# Altium schematic sheet 3_mcu_main.schdoc: OBDH MCU Main
size A3; Engineer: Eng_2_ALT; SheetNumber: 3; SheetTotal: 6; Designed by: André M. P. Mattos; Version: v0.7; ProjectRevision: v0.7; ProjectCode: obdh2
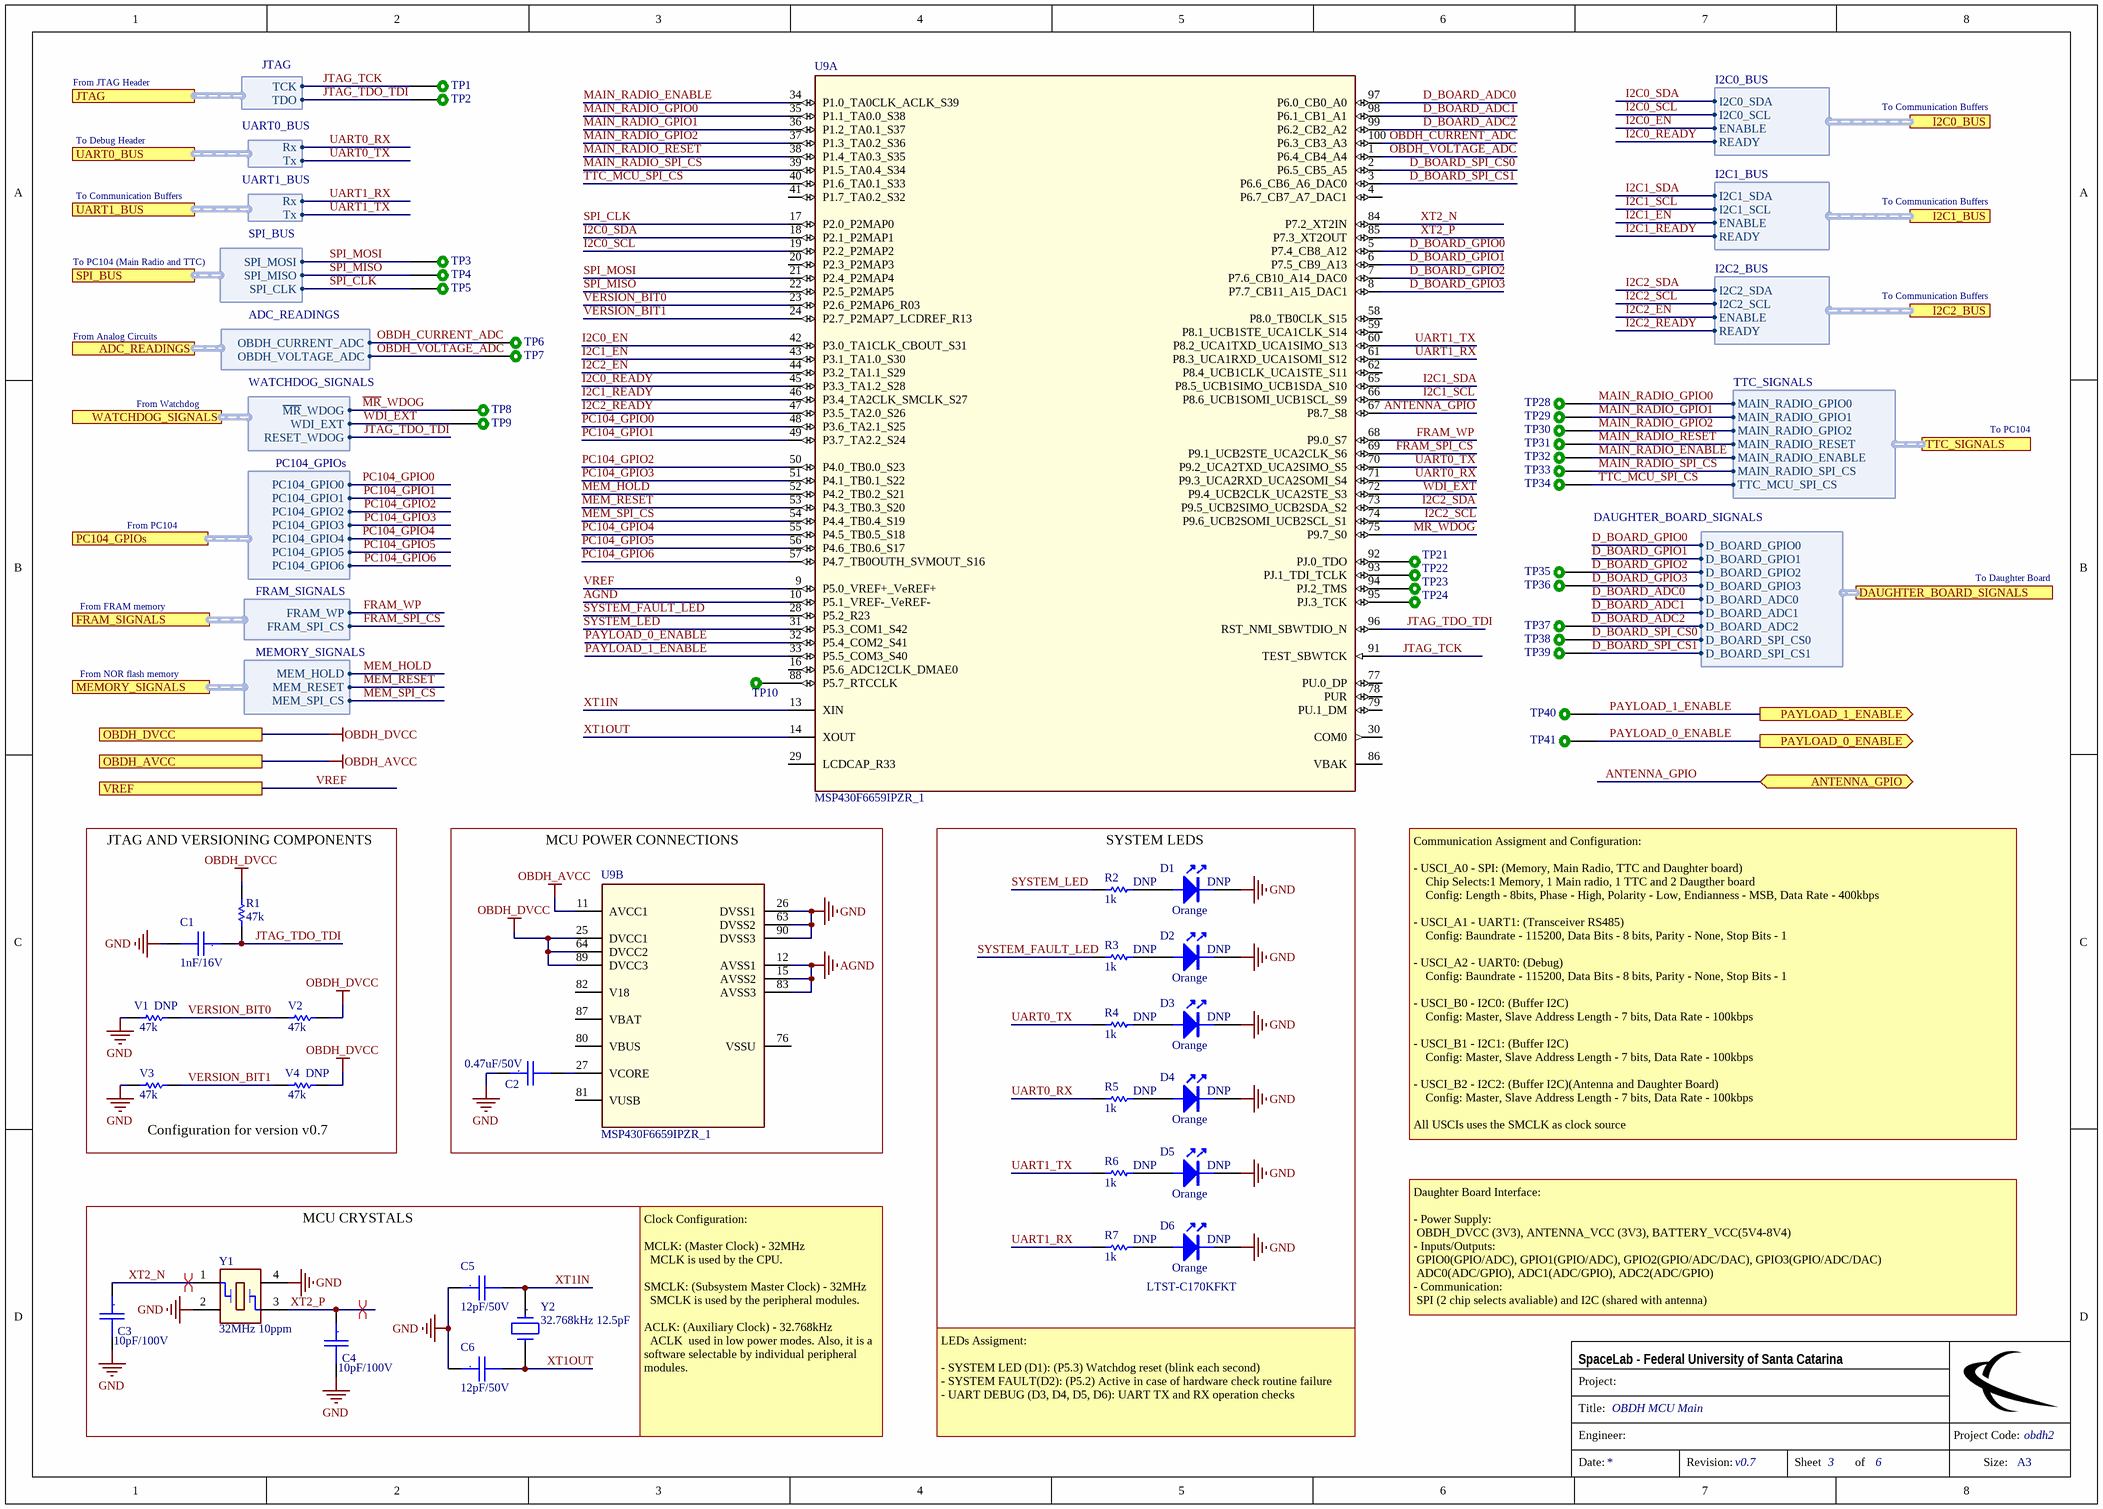
[diagram p0: 3_mcu_main.schdoc]

## Parts
C1  1nF/16V  [CC0805]
C2  0.47uF/50V  [CC0805]
C3  10pF/100V  [CC0805]
C4  10pF/100V  [CC0805]
C5  12pF/50V  [CC0805]
C6  12pF/50V  [CC0805]
D1  Orange  [0805-LED]
D2  Orange  [0805-LED]
D3  Orange  [0805-LED]
D4  Orange  [0805-LED]
D5  Orange  [0805-LED]
D6  Orange  [0805-LED]
R1  47k  [0805]
R2  1k  [0805]
R3  1k  [0805]
R4  1k  [0805]
R5  1k  [0805]
R6  1k  [0805]
R7  1k  [0805]
TP1  TEST_POINT_2  [TEST_POINT_2]  (value not drawn)  (no BOM)
TP2  TEST_POINT_2  [TEST_POINT_2]  (value not drawn)  (no BOM)
TP3  TEST_POINT_2  [TEST_POINT_2]  (value not drawn)  (no BOM)
TP4  TEST_POINT_2  [TEST_POINT_2]  (value not drawn)  (no BOM)
TP5  TEST_POINT_2  [TEST_POINT_2]  (value not drawn)  (no BOM)
TP6  TEST_POINT_2  [TEST_POINT_2]  (value not drawn)  (no BOM)
TP7  TEST_POINT_2  [TEST_POINT_2]  (value not drawn)  (no BOM)
TP8  TEST_POINT_2  [TEST_POINT_2]  (value not drawn)  (no BOM)
TP9  TEST_POINT_2  [TEST_POINT_2]  (value not drawn)  (no BOM)
TP10  TEST_POINT_2  [TEST_POINT_2]  (value not drawn)  (no BOM)
TP21  TEST_POINT_2  [TEST_POINT_2]  (value not drawn)  (no BOM)
TP22  TEST_POINT_2  [TEST_POINT_2]  (value not drawn)  (no BOM)
TP23  TEST_POINT_2  [TEST_POINT_2]  (value not drawn)  (no BOM)
TP24  TEST_POINT_2  [TEST_POINT_2]  (value not drawn)  (no BOM)
TP28  TEST_POINT_2  [TEST_POINT_2]  (value not drawn)  (no BOM)
TP29  TEST_POINT_2  [TEST_POINT_2]  (value not drawn)  (no BOM)
TP30  TEST_POINT_2  [TEST_POINT_2]  (value not drawn)  (no BOM)
TP31  TEST_POINT_2  [TEST_POINT_2]  (value not drawn)  (no BOM)
TP32  TEST_POINT_2  [TEST_POINT_2]  (value not drawn)  (no BOM)
TP33  TEST_POINT_2  [TEST_POINT_2]  (value not drawn)  (no BOM)
TP34  TEST_POINT_2  [TEST_POINT_2]  (value not drawn)  (no BOM)
TP35  TEST_POINT_2  [TEST_POINT_2]  (value not drawn)  (no BOM)
TP36  TEST_POINT_2  [TEST_POINT_2]  (value not drawn)  (no BOM)
TP37  TEST_POINT_2  [TEST_POINT_2]  (value not drawn)  (no BOM)
TP38  TEST_POINT_2  [TEST_POINT_2]  (value not drawn)  (no BOM)
TP39  TEST_POINT_2  [TEST_POINT_2]  (value not drawn)  (no BOM)
TP40  TEST_POINT_2  [TEST_POINT_2]  (value not drawn)  (no BOM)
TP41  TEST_POINT_2  [TEST_POINT_2]  (value not drawn)  (no BOM)
U9  MSP430F6659IPZR_1  [PZ0100A_N]  (parts A,B of 2)
V1  47k  [0805]
V2  47k  [0805]
V3  47k  [0805]
V4  47k  [0805]
Y1  32MHz 10ppm  [XTAL_ABM8X]
Y2  32.768kHz 12.5pF  [ABS06 0805]

## Blocks framed on the sheet
MCU POWER CONNECTIONS: C2 U9
SYSTEM LEDS: D1-D6 R2-R7
MCU CRYSTALS: C3-C6 Y1 Y2

## Ports
ADC_READINGS (harness ADC_READINGS), ANTENNA_GPIO (bidir), DAUGHTER_BOARD_SIGNALS (harness DAUGHTER_BOARD_SIGNALS), FRAM_SIGNALS (harness FRAM_SIGNALS), I2C0_BUS (harness I2C0_BUS), I2C1_BUS (harness I2C1_BUS), I2C2_BUS (harness I2C2_BUS), JTAG (harness JTAG), MEMORY_SIGNALS (harness MEMORY_SIGNALS), OBDH_AVCC, OBDH_DVCC, PAYLOAD_0_ENABLE (out), PAYLOAD_1_ENABLE (out), PC104_GPIOs (harness PC104_GPIOs), SPI_BUS (harness SPI_BUS), TTC_SIGNALS (harness TTC_SIGNALS), UART0_BUS (harness UART0_BUS), UART1_BUS (harness UART1_BUS), VREF, WATCHDOG_SIGNALS (harness WATCHDOG_SIGNALS)

## Harnesses
JTAG: TDO, TCK
UART0_BUS: Rx, Tx
ADC_READINGS: OBDH_CURRENT_ADC, OBDH_VOLTAGE_ADC
UART1_BUS: Rx, Tx
I2C0_BUS: I2C0_SCL, I2C0_SDA, ENABLE, READY
I2C1_BUS: I2C1_SCL, I2C1_SDA, ENABLE, READY
I2C2_BUS: I2C2_SCL, I2C2_SDA, ENABLE, READY
SPI_BUS: SPI_CLK, SPI_MISO, SPI_MOSI
TTC_SIGNALS: MAIN_RADIO_GPIO0, MAIN_RADIO_GPIO1, MAIN_RADIO_GPIO2, MAIN_RADIO_RESET, MAIN_RADIO_ENABLE, MAIN_RADIO_SPI_CS, TTC_MCU_SPI_CS
DAUGHTER_BOARD_SIGNALS: D_BOARD_GPIO3, D_BOARD_GPIO2, D_BOARD_ADC0, D_BOARD_ADC1, D_BOARD_GPIO1, D_BOARD_GPIO0, D_BOARD_ADC2, D_BOARD_SPI_CS0, D_BOARD_SPI_CS1
WATCHDOG_SIGNALS: ~{MR}_WDOG, WDI_EXT, RESET_WDOG
PC104_GPIOs: PC104_GPIO0, PC104_GPIO1, PC104_GPIO2, PC104_GPIO3, PC104_GPIO4, PC104_GPIO5, PC104_GPIO6
MEMORY_SIGNALS: MEM_SPI_CS, MEM_RESET, MEM_HOLD
FRAM_SIGNALS: FRAM_SPI_CS, FRAM_WP

## Nets
AGND: U9.10(P5.1_VREF-_VeREF-) U9.12(AVSS1) U9.15(AVSS2) U9.83(AVSS3)
GND: C1.2 C2.1 C3.2 C4.2 C5.1 C6.1 D1.2(K) D2.2(K) D3.2(K) D4.2(K) D5.2(K) D6.2(K) U9.26(DVSS1) U9.63(DVSS2) U9.90(DVSS3) V1.2 V3.2 Y1.2 Y1.4
OBDH_AVCC: U9.11(AVCC1) ; port OBDH_AVCC
OBDH_DVCC: R1.2 U9.25(DVCC1) U9.64(DVCC2) U9.89(DVCC3) V2.1 V4.1 ; port OBDH_DVCC
~{MR}_WDOG: TP8.1 U9.75(P9.7_S0) ; port WATCHDOG_SIGNALS.~{MR}_WDOG
ANTENNA_GPIO: U9.67(P8.7_S8) ; port ANTENNA_GPIO
D_BOARD_ADC0: U9.97(P6.0_CB0_A0) ; port DAUGHTER_BOARD_SIGNALS.D_BOARD_ADC0
D_BOARD_ADC1: U9.98(P6.1_CB1_A1) ; port DAUGHTER_BOARD_SIGNALS.D_BOARD_ADC1
D_BOARD_ADC2: TP37.1 U9.99(P6.2_CB2_A2) ; port DAUGHTER_BOARD_SIGNALS.D_BOARD_ADC2
D_BOARD_GPIO0: U9.5(P7.4_CB8_A12) ; port DAUGHTER_BOARD_SIGNALS.D_BOARD_GPIO0
D_BOARD_GPIO1: U9.6(P7.5_CB9_A13) ; port DAUGHTER_BOARD_SIGNALS.D_BOARD_GPIO1
D_BOARD_GPIO2: TP35.1 U9.7(P7.6_CB10_A14_DAC0) ; port DAUGHTER_BOARD_SIGNALS.D_BOARD_GPIO2
D_BOARD_GPIO3: TP36.1 U9.8(P7.7_CB11_A15_DAC1) ; port DAUGHTER_BOARD_SIGNALS.D_BOARD_GPIO3
D_BOARD_SPI_CS0: TP38.1 U9.2(P6.5_CB5_A5) ; port DAUGHTER_BOARD_SIGNALS.D_BOARD_SPI_CS0
D_BOARD_SPI_CS1: TP39.1 U9.3(P6.6_CB6_A6_DAC0) ; port DAUGHTER_BOARD_SIGNALS.D_BOARD_SPI_CS1
FRAM_SPI_CS: U9.69(P9.1_UCB2STE_UCA2CLK_S6) ; port FRAM_SIGNALS.FRAM_SPI_CS
FRAM_WP: U9.68(P9.0_S7) ; port FRAM_SIGNALS.FRAM_WP
I2C0_EN: U9.42(P3.0_TA1CLK_CBOUT_S31) ; port I2C0_BUS.ENABLE
I2C0_READY: U9.45(P3.3_TA1.2_S28) ; port I2C0_BUS.READY
I2C0_SCL: U9.19(P2.2_P2MAP2) ; port I2C0_BUS.I2C0_SCL
I2C0_SDA: U9.18(P2.1_P2MAP1) ; port I2C0_BUS.I2C0_SDA
I2C1_EN: U9.43(P3.1_TA1.0_S30) ; port I2C1_BUS.ENABLE
I2C1_READY: U9.46(P3.4_TA2CLK_SMCLK_S27) ; port I2C1_BUS.READY
I2C1_SCL: U9.66(P8.6_UCB1SOMI_UCB1SCL_S9) ; port I2C1_BUS.I2C1_SCL
I2C1_SDA: U9.65(P8.5_UCB1SIMO_UCB1SDA_S10) ; port I2C1_BUS.I2C1_SDA
I2C2_EN: U9.44(P3.2_TA1.1_S29) ; port I2C2_BUS.ENABLE
I2C2_READY: U9.47(P3.5_TA2.0_S26) ; port I2C2_BUS.READY
I2C2_SCL: U9.74(P9.6_UCB2SOMI_UCB2SCL_S1) ; port I2C2_BUS.I2C2_SCL
I2C2_SDA: U9.73(P9.5_UCB2SIMO_UCB2SDA_S2) ; port I2C2_BUS.I2C2_SDA
JTAG_TCK: TP1.1 U9.91(TEST_SBWTCK) ; port JTAG.TCK
JTAG_TDO_TDI: C1.1 R1.1 TP2.1 U9.96(RST_NMI_SBWTDIO_N) ; port JTAG.TDO, port WATCHDOG_SIGNALS.RESET_WDOG
MAIN_RADIO_ENABLE: TP32.1 U9.34(P1.0_TA0CLK_ACLK_S39) ; port TTC_SIGNALS.MAIN_RADIO_ENABLE
MAIN_RADIO_GPIO0: TP28.1 U9.35(P1.1_TA0.0_S38) ; port TTC_SIGNALS.MAIN_RADIO_GPIO0
MAIN_RADIO_GPIO1: TP29.1 U9.36(P1.2_TA0.1_S37) ; port TTC_SIGNALS.MAIN_RADIO_GPIO1
MAIN_RADIO_GPIO2: TP30.1 U9.37(P1.3_TA0.2_S36) ; port TTC_SIGNALS.MAIN_RADIO_GPIO2
MAIN_RADIO_RESET: TP31.1 U9.38(P1.4_TA0.3_S35) ; port TTC_SIGNALS.MAIN_RADIO_RESET
MAIN_RADIO_SPI_CS: TP33.1 U9.39(P1.5_TA0.4_S34) ; port TTC_SIGNALS.MAIN_RADIO_SPI_CS
MEM_HOLD: U9.52(P4.2_TB0.2_S21) ; port MEMORY_SIGNALS.MEM_HOLD
MEM_RESET: U9.53(P4.3_TB0.3_S20) ; port MEMORY_SIGNALS.MEM_RESET
MEM_SPI_CS: U9.54(P4.4_TB0.4_S19) ; port MEMORY_SIGNALS.MEM_SPI_CS
OBDH_CURRENT_ADC: TP6.1 U9.100(P6.3_CB3_A3) ; port ADC_READINGS.OBDH_CURRENT_ADC
OBDH_VOLTAGE_ADC: TP7.1 U9.1(P6.4_CB4_A4) ; port ADC_READINGS.OBDH_VOLTAGE_ADC
PAYLOAD_0_ENABLE: TP41.1 U9.32(P5.4_COM2_S41) ; port PAYLOAD_0_ENABLE
PAYLOAD_1_ENABLE: TP40.1 U9.33(P5.5_COM3_S40) ; port PAYLOAD_1_ENABLE
PC104_GPIO0: U9.48(P3.6_TA2.1_S25) ; port PC104_GPIOs.PC104_GPIO0
PC104_GPIO1: U9.49(P3.7_TA2.2_S24) ; port PC104_GPIOs.PC104_GPIO1
PC104_GPIO2: U9.50(P4.0_TB0.0_S23) ; port PC104_GPIOs.PC104_GPIO2
PC104_GPIO3: U9.51(P4.1_TB0.1_S22) ; port PC104_GPIOs.PC104_GPIO3
PC104_GPIO4: U9.55(P4.5_TB0.5_S18) ; port PC104_GPIOs.PC104_GPIO4
PC104_GPIO5: U9.56(P4.6_TB0.6_S17) ; port PC104_GPIOs.PC104_GPIO5
PC104_GPIO6: U9.57(P4.7_TB0OUTH_SVMOUT_S16) ; port PC104_GPIOs.PC104_GPIO6
SPI_CLK: TP5.1 U9.17(P2.0_P2MAP0) ; port SPI_BUS.SPI_CLK
SPI_MISO: TP4.1 U9.22(P2.5_P2MAP5) ; port SPI_BUS.SPI_MISO
SPI_MOSI: TP3.1 U9.21(P2.4_P2MAP4) ; port SPI_BUS.SPI_MOSI
SYSTEM_FAULT_LED: R3.2 U9.28(P5.2_R23)
SYSTEM_LED: R2.2 U9.31(P5.3_COM1_S42)
TTC_MCU_SPI_CS: TP34.1 U9.40(P1.6_TA0.1_S33) ; port TTC_SIGNALS.TTC_MCU_SPI_CS
UART0_RX: R5.2 U9.71(P9.3_UCA2RXD_UCA2SOMI_S4) ; port UART0_BUS.Rx
UART0_TX: R4.2 U9.70(P9.2_UCA2TXD_UCA2SIMO_S5) ; port UART0_BUS.Tx
UART1_RX: R7.2 U9.61(P8.3_UCA1RXD_UCA1SOMI_S12) ; port UART1_BUS.Rx
UART1_TX: R6.2 U9.60(P8.2_UCA1TXD_UCA1SIMO_S13) ; port UART1_BUS.Tx
VERSION_BIT0: U9.23(P2.6_P2MAP6_R03) V1.1 V2.2
VERSION_BIT1: U9.24(P2.7_P2MAP7_LCDREF_R13) V3.1 V4.2
VREF: U9.9(P5.0_VREF+_VeREF+) ; port VREF
WDI_EXT: TP9.1 U9.72(P9.4_UCB2CLK_UCA2STE_S3) ; port WATCHDOG_SIGNALS.WDI_EXT
XT1IN: C5.2 U9.13(XIN) Y2.1
XT1OUT: C6.2 U9.14(XOUT) Y2.2
XT2_N: C3.1 U9.84(P7.2_XT2IN) Y1.1
XT2_P: C4.1 U9.85(P7.3_XT2OUT) Y1.3
NetC2_2: C2.2 U9.27(VCORE)
NetD1_1: D1.1(A) R2.1
NetD2_1: D2.1(A) R3.1
NetD3_1: D3.1(A) R4.1
NetD4_1: D4.1(A) R5.1
NetD5_1: D5.1(A) R6.1
NetD6_1: D6.1(A) R7.1
NetTP10_1: TP10.1 U9.88(P5.7_RTCCLK)
NetTP21_1: TP21.1 U9.92(PJ.0_TDO)
NetTP22_1: TP22.1 U9.93(PJ.1_TDI_TCLK)
NetTP23_1: TP23.1 U9.94(PJ.2_TMS)
NetTP24_1: TP24.1 U9.95(PJ.3_TCK)

Not connected (* = marked no-connect by the designer): U9 4(P6.7_CB7_A7_DAC1) 16(P5.6_ADC12CLK_DMAE0) 20(P2.3_P2MAP3) 29(LCDCAP_R33) 30(COM0) 41(P1.7_TA0.2_S32) 58(P8.0_TB0CLK_S15) 59(P8.1_UCB1STE_UCA1CLK_S14) 62(P8.4_UCB1CLK_UCA1STE_S11) 76(VSSU) 77(PU.0_DP) 78(PUR) 79(PU.1_DM) 80(VBUS) 81(VUSB) 82(V18) 86(VBAK) 87(VBAT)

## Layout directives
differential pair: XT2_N, XT2_P

## Notes on the sheet
- From JTAG Header
- To Communication Buffers
- To Debug Header
- To PC104 (Main Radio and TTC)
- From Analog Circuits
- From Watchdog
- To PC104
- From PC104
- To Daughter Board
- From FRAM memory
- From NOR flash memory
- (near R1) JTAG AND VERSIONING COMPONENTS
- (near R2) DNP
- (near D1) DNP
- (near R3) DNP
- (near D2) DNP
- (near V1) DNP
- (near R4) DNP
- (near D3) DNP
- (near V4) DNP
- (near R5) DNP
- (near D4) DNP
- Configuration for version v0.7
- (near R6) DNP
- (near D5) DNP
- Communication Assigment and Configuration:
  - USCI_A0 - SPI: (Memory, Main Radio, TTC and Daughter board)
  Chip Selects:1 Memory, 1 Main radio, 1 TTC and 2 Daugther board
  Config: Length - 8bits, Phase - High, Polarity - Low, Endianness - MSB, Data Rate - 400kbps
  - USCI_A1 - UART1: (Transceiver RS485)
  Config: Baundrate - 115200, Data Bits - 8 bits, Parity - None, Stop Bits - 1
  - USCI_A2 - UART0: (Debug)
  Config: Baundrate - 115200, Data Bits - 8 bits, Parity - None, Stop Bits - 1
  - USCI_B0 - I2C0: (Buffer I2C)
  Config: Master, Slave Address Length - 7 bits, Data Rate - 100kbps
  - USCI_B1 - I2C1: (Buffer I2C)
  Config: Master, Slave Address Length - 7 bits, Data Rate - 100kbps
  - USCI_B2 - I2C2: (Buffer I2C)(Antenna and Daughter Board)
  Config: Master, Slave Address Length - 7 bits, Data Rate - 100kbps
  All USCIs uses the SMCLK as clock source
- (near R7) DNP
- (near D6) DNP
- LTST-C170KFKT
- Daughter Board Interface:
  - Power Supply:
  OBDH_DVCC (3V3), ANTENNA_VCC (3V3), BATTERY_VCC(5V4-8V4)
  - Inputs/Outputs:
  GPIO0(GPIO/ADC), GPIO1(GPIO/ADC), GPIO2(GPIO/ADC/DAC), GPIO3(GPIO/ADC/DAC)
  ADC0(ADC/GPIO), ADC1(ADC/GPIO), ADC2(ADC/GPIO)
  - Communication:
  SPI (2 chip selects avaliable) and I2C (shared with antenna)
- Clock Configuration:
  MCLK: (Master Clock) - 32MHz
  MCLK is used by the CPU.
  SMCLK: (Subsystem Master Clock) - 32MHz
  SMCLK is used by the peripheral modules.
  ACLK: (Auxiliary Clock) - 32.768kHz
  ACLK  used in low power modes. Also, it is a software selectable by individual peripheral modules.
- LEDs Assigment:
  - SYSTEM LED (D1): (P5.3) Watchdog reset (blink each second)
  - SYSTEM FAULT(D2): (P5.2) Active in case of hardware check routine failure
  - UART DEBUG (D3, D4, D5, D6): UART TX and RX operation checks
- Project:
- SpaceLab - Federal University of Santa Catarina
- Title:
- Engineer:
- Project Code:
- Date:
- Revision:
- Sheet
- of
- Size:
- A3
- (in symbol Cap_Cer_X7R_0.47uF_50V_0805) .
- (in symbol Cap_Cer_X7R_1nF_16V_0603) .
- (in symbol Cap_Cer_X7R_10pF_100V_0805) .
- (in symbol Cap_Cer_X7R_12pF_50V_0805) .
- (in symbol Xtal_32.768kHz_12pF_2_SMD) .

## Library data of the parts
C1 = Cap_Cer_X7R_1nF_16V_0603: CAP CER 1nF 16V 0603 5%; Partnumber: C0603X102J4RECAUTO; NCM: 8532.24.10
C2 = Cap_Cer_X7R_0.47uF_50V_0805: CAP CER 0.47UF 50V 10% X7R 0805; Partnumber: C0805C474K5RACTU; NCM: 8532.24.10
C3 C4 = Cap_Cer_X7R_10pF_100V_0805: CAP CER 10pF 100V 0805; Partnumber: 08051A100FAT2A; NCM: 8532.24.10
C5 C6 = Cap_Cer_X7R_12pF_50V_0805: CAP CER 12pF 50V 0805; Partnumber: CL21C120FBANNNC; NCM: 8532.24.10
D1-D6 = LED/R_0603: SMD Orange LED; Partnumber: LTST-C170KFKT; NCM: 8541.40.21
R1 V1-V4 = R47k_1%_1/8W_0805: RES 47k OHM 1/8W 1% 0805; Partnumber: RC0805FR-0747KL; NCM: 8533.21.20
R2-R7 = R1.0k_1%_1/8W_0805: RES 1.0K OHM 1/8W 1% 0805; Partnumber: RC0805FR-071KL; NCM: 8533.21.20
TP1-TP10 TP21-TP24 TP28-TP41 = TEST_POINT_2: Test point
U9 = MSP430F6659IPZR_1: Imported; Manufacturer: Texas Instruments; CompType: IC; PIN_COUNT: 100; Application_BuildNumber: *; PartNumber: MSP430F6659IPZR; Alternate PartNumber: MSP430F6659IPZ; PackageReference: PZ0100A; MountType: SMT; RoHS: Y; RefDes: RefDes; Type: DEV; Value: Value
Y1 = XTAL_32MHz_SMD_4-SMD: 32MHz ±10ppm Crystal 10pF 60 Ohm -40°C ~ 125°C; Partnumber: ABM8X-102-32.000MHZ-T; NCM: 8541.60.10
Y2 = Xtal_32.768kHz_12pF_2_SMD: 32.768kHz ±20ppm Crystal 12.5pF 70 kOhm -40°C ~ 125°C; Partnumber: ECS-.327-12.5-34S-TR; NCM: 8541.60.10